# EAGLE design VentilationSensor_SFM3x_Coupler_v1.0_nov2021 (EAGLE 9.6.2)
TEST: 1234
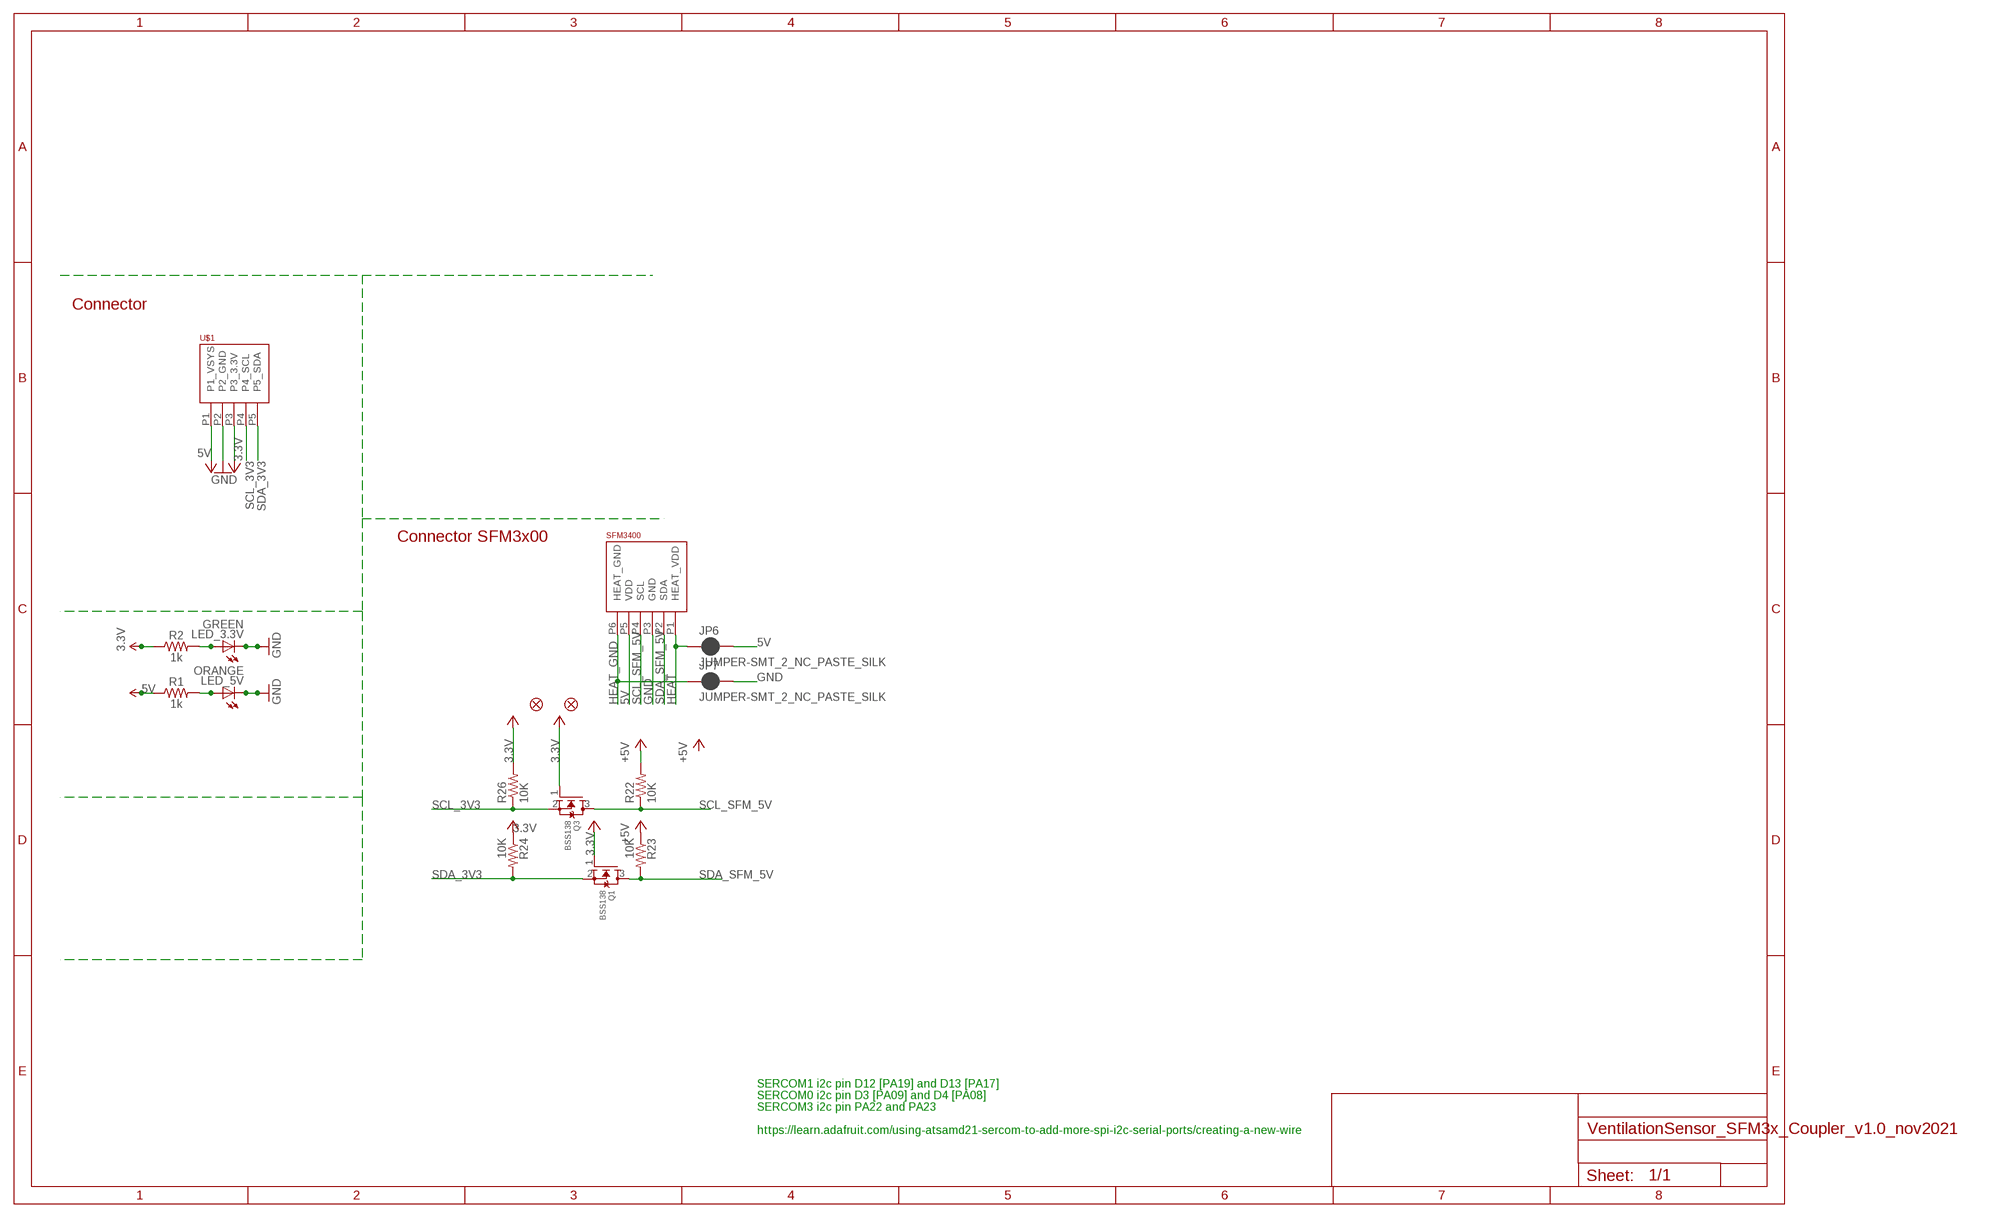
[diagram p0: schematic, sheet 1]

## Parts
FD1  FIDUCIAL1X2  [FIDUCIAL-1X2]
FD2  FIDUCIAL1X2  [FIDUCIAL-1X2]
JP6  JUMPER-SMT_2_NC_PASTE_SILK  [SMT-JUMPER_2_NC_PASTE_SILK]
JP7  JUMPER-SMT_2_NC_PASTE_SILK  [SMT-JUMPER_2_NC_PASTE_SILK]
LED_3.3V  GREEN  LED0603  [LED-0603]
LED_5V  ORANGE  LED0603  [LED-0603]
Q1  BSS138  MOSFET-NREFLOW  [SOT23]
Q3  BSS138  MOSFET-NREFLOW  [SOT23]
R1  1k  1KOHM-0603-1/10W-1%  [0603]
R2  1k  1KOHM-0603-1/10W-1%  [0603]
R22  10K  R-US_R0805  [R0805]
R23  10K  R-US_R0805  [R0805]
R24  10K  R-US_R0805  [R0805]
R26  10K  R-US_R0805  [R0805]
SFM3400  SFMXX00  [SFMXX00]
U$1  PHOENIX_PTSM_M5_TH_I2C++  [PTSM_M5_THRHOLE]

## Nets
3.3V [power]: Q1.1(G) Q3.1(G) R2.1 R24.1 R26.2 U$1.P3(P3_3.3V) ; supply symbol labelled +3V3
5V [power]: JP6.2 R1.1 R22.2 R23.1 SFM3400.P5(VDD) U$1.P1(P1_VSYS) ; supply symbol labelled +5V, 3.3V
GND [power]: JP7.2 LED_3.3V.C LED_5V.C SFM3400.P3(GND) U$1.P2(P2_GND)
HEAT [power]: JP6.1 SFM3400.P1(HEAT_VDD)
HEAT_GND [power]: JP7.1 SFM3400.P6(HEAT_GND)
N$1: LED_5V.A R1.2
N$33: LED_3.3V.A R2.2
SCL_3V3: Q3.2(S) R26.1 U$1.P4(P4_SCL)
SCL_SFM_5V: Q3.3(D) R22.1 SFM3400.P4(SCL)
SDA_3V3: Q1.2(S) R24.2 U$1.P5(P5_SDA)
SDA_SFM_5V: Q1.3(D) R23.2 SFM3400.P2(SDA)

## Notes on the sheet
- Connector
- Connector SFM3x00
- SERCOM1 i2c pin D12 [PA19] and D13 [PA17]
- SERCOM0 i2c pin D3 [PA09] and D4 [PA08]
- SERCOM3 i2c pin PA22 and PA23
- https://learn.adafruit.com/using-atsamd21-sercom-to-add-more-spi-i2c-serial-ports/creating-a-new-wire

## Library data of the parts
FD1 FD2 = SparkFun-Aesthetics:FIDUCIAL: Fiducial Alignment Points Point-of-reference for pick-and-place machines and other optical instruments.
JP6 JP7 = SparkFun-Jumpers:JUMPER-SMT_2_NC_PASTE: Normally closed solder jumper This jumper has an aperture in the stencil to allow solder paste to bridge the split in the wire so it's normally closed (NC). Wick off the solder to open the connection. Reapply solder to reclose the connection.
LED_3.3V LED_5V = SparkFun:LED: LEDs Standard schematic elements and footprints for 5mm, 3mm, 1206, and 0603 sized LEDs. 5mm - Spark Fun Electronics SKU : COM-00529 (and others)
Q1 Q3 = adafruit:MOSFET-N: N-Channel Mosfet 2N7002E - 60V 260mA SOT23 [Digikey: 2N7002ET1GOSTR-ND] - REEL BSH103 - 30V 850mA SOT23 [Digikey: 568-5013-1-ND]
R1 R2 = SparkFun-Resistors:1KOHM: 1kΩ resistor A resistor is a passive two-terminal electrical component that implements electrical resistance as a circuit element. Resistors act to reduce current flow, and, at the same time, act to lower voltage levels within circuits. - Wikipedia; PROD_ID: RES-07856
R22-R24 R26 = adafruit:R-US_: RESISTOR, American symbol
SFM3400 = jk_customs:SFMXX00
U$1 = jk_customs:PHOENIX_PTSM_M5_TH: Datasheet Phoenix PTSM 0,5/ 5-HH-2,5-THR R32 <https://www.phoenixcontact.com/online/portal/us?uri=pxc-oc-itemdetail:pid=1778654&library=usen&pdfmode=direct&pdflanguage=en>

## Net classes
2 ground: width 0.254 mm, drill 0.254 mm, clearance 0.152 mm
3 power: width 0.33 mm, drill 0.254 mm, clearance 0.152 mm

## Board
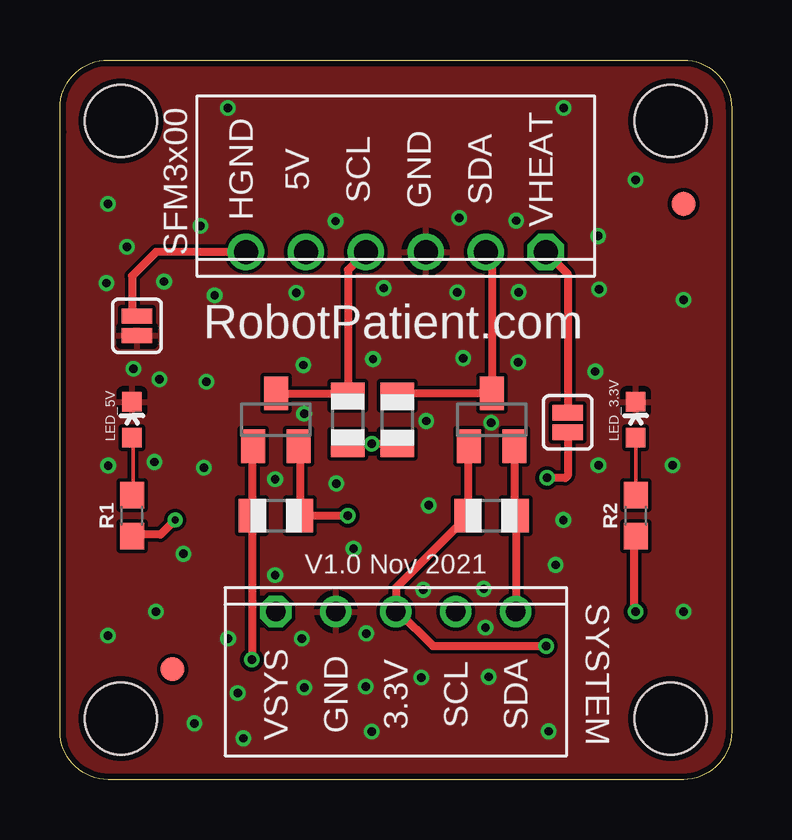
[diagram p1: board, top side]
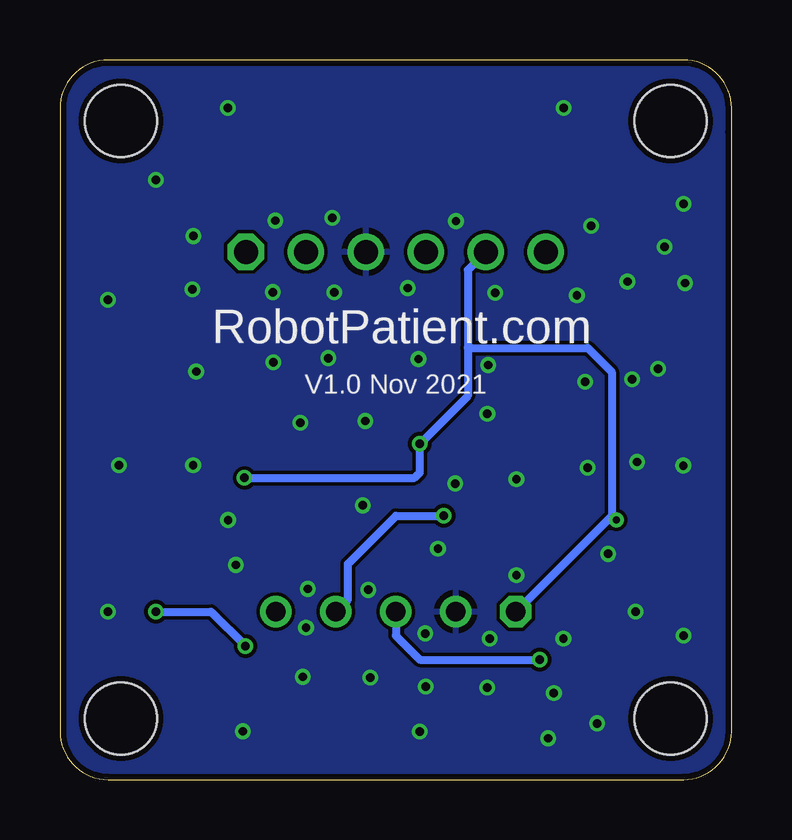
[diagram p2: board, bottom side, seen from below]

Size 28 x 30 mm. Coordinates in mm from the lower left corner, seen from the top.
Outline: 0.01,27 0.01,27
Outline: 26,0 2,0 arc-90 0,2 0,28 arc-90 2,30 26,30 arc-90 28,28 28,2 arc-90 26,0
Copper layers (1*16): Top 0.035mm / dielectric 1.5mm / Bottom 0.035mm
Design rules "ITEADstudio_DRC_Recent_june2014": minimum track width 6mil, minimum drill 12mil, track to track 6mil, track to pad 6mil, pad to pad 6mil, via to via 6mil, smd to smd 0mil, copper to edge 10mil, drill to drill 10mil, minimum pad ring 10mil, minimum via ring 6mil, stop-mask expansion 2mil, vias tented up to drill 100mil, thermal gap 10mil
Holes 3 mm at 2.54,2.54 2.54,27.46 25.46,27.46 25.46,2.54

### Footprints (pad centres in the part's own frame; a part is rotated, then mirrored left to right if it is on the bottom)
FIDUCIAL-1X2 = smd 1 x 1: 1 0,0
SMT-JUMPER_2_NC_PASTE_SILK = smd 0.635 x 1.27: 1 -0.406,0; 2 0.406,0
LED-0603 = smd 0.8 x 0.8: A 0,-0.75; C 0,0.75
SOT23 = smd 1 x 1.4: 1 -0.95,-1.1; 2 0.95,-1.1; 3 0,1.1
0603 = smd 1.1 x 1: 1 -0.85,0; 2 0.85,0
R0805 = smd 1.1 x 1.4: 1 -1,0; 2 1,0
SFMXX00 = drill 1 octagon: P1 6.25,1 | drill 1: P2 3.75,1; P3 1.25,1; P4 -1.25,1; P5 -3.75,1; P6 -6.25,1
PTSM_M5_THRHOLE = drill 0.8 octagon: P1 5,1 | drill 0.8: P2 2.5,1; P3 0,1; P4 -2.5,1; P5 -5,1

### Placement (x,y rotation side)
FD1  4.69,4.6 0 top
FD2  26,24 0 top
JP6  21.17,14.89 270 top
JP7  3.21,18.92 270 top
LED_3.3V  24,15 0 top
LED_5V  3,15 0 top
Q1  18,15 0 top
Q3  9,15 0 top
R1  3,11 90 top
R2  24,11 90 top
R22  12,15 270 top
R23  14.07,15 90 top
R24  18,11 0 top
R26  9,11 180 top
SFM3400  14,21 0 top
U$1  14,8 180 top

### Tracks (layer width: path | path; a pad name or v marks a point on that pad's centre or on a via)
3.3V  (via drill 0.35)
  Top 0.33: Q3.1 8,13.85 R26.2 v8,5 | Q1.1 17,13.85 R24.1 14,8 U$1.P3 14.1,7.01 15.54,5.56 v20.27,5.56 | R2.1 23.93,10.13 23.93,7.07 v24,7
  Bottom 0.33: U$1.P3 14,6 13,5 v8,5 | v24,7 21.71,7 v20.27,5.56
5V  (via drill 0.3, 0.35)
  Top 0.33: JP6.2 21.17,12.67 21.07,12.57 v20.32,12.57 v20.31,12.58 | R22.2 v13,14 R23.1 | v4.8,10.82 4.19,10.21 3.05,10.21 R1.1
  Bottom 0.33: v20.31,12.58 13.22,12.58 13,12.8 v13,14 11,16 11,18 | SFM3400.P5 11,21.25 11,18 | 11,18 6,18 5,17 5,11 | 5,11 U$1.P1 | v4.8,10.82 4.88,10.9 5,11
GND  (via drill 0.35)
  other vias: 6,13 8.97,12.52 8.97,8.52 15.14,7.91 17.67,7.95 20.67,8.95 17.98,14.87 15.27,14.95 10.18,15.25 10.14,17.28 13.05,17.53 16.81,17.57 19.1,17.4 22.45,13.1 22.32,17.01 25.54,13.11 17.74,6.33 17.88,4.28 15.06,4.25 12.75,3.87 10.19,3.83 7.01,5.88 10.08,5.88 7.41,3.61 5.15,9.41 2.01,13.09 3.94,13.24 3.06,17.12 4.34,20.76 1.94,20.7 2.79,22.21 5.86,23.08 11.49,23.28 9.86,20.29 13.5,20.49 16.64,23.42 16.56,20.31 19.13,20.32 19.02,23.3 22.44,22.66 22.48,20.44 20.99,10.82 15.38,11.43 11.52,12.34 12.24,9.63 12.77,6.09 4,7 2,6 2,24 7,28 21,28 26,20 24,25 26,7 20.38,2.01 7.65,1.72 5.61,2.34 13,2 6.1,16.58 6.45,20.19 4.15,16.69
  pour Bottom: -2.63,51.67 87.5,51.88 87.5,-2.53 -2.63,-2.53
  pour Top: 96.5,61.68 96.5,-4.53 -5.63,-4.53 -5.63,61.68
HEAT
  Top 0.33: SFM3400.P1 21.17,21.08 JP6.1
HEAT_GND
  Top 0.33: SFM3400.P6 4,22 3,21 3,19.54 JP7.1
N$1
  Top 0.152: LED_5V.A 3.05,14.25 3.05,11.89 R1.2
N$33
  Top 0.152: LED_3.3V.A 24,11.89 R2.2
SCL_3V3  (via drill 0.35)
  Top 0.33: Q3.2 10,13.85 R26.1 v12,11
  Bottom 0.33: U$1.P4 16,7.5 16,9 14,11 v12,11
SCL_SFM_5V
  Top 0.33: SFM3400.P4 12,21.25 R22.1 11.9,16.1 Q3.3
SDA_3V3
  Top 0.33: Q1.2 18.95,11.05 R24.2 U$1.P5
SDA_SFM_5V
  Top 0.33: R23.2 14.17,16.1 Q1.3 18,21.75 SFM3400.P2

### Text on the board
_tsilk: SFM3x00 | RobotPatient.com | SYSTEM
_bsilk: RobotPatient.com